# EAGLE schematic MotherForSmoothie_preliminary (EAGLE 6.6.0)
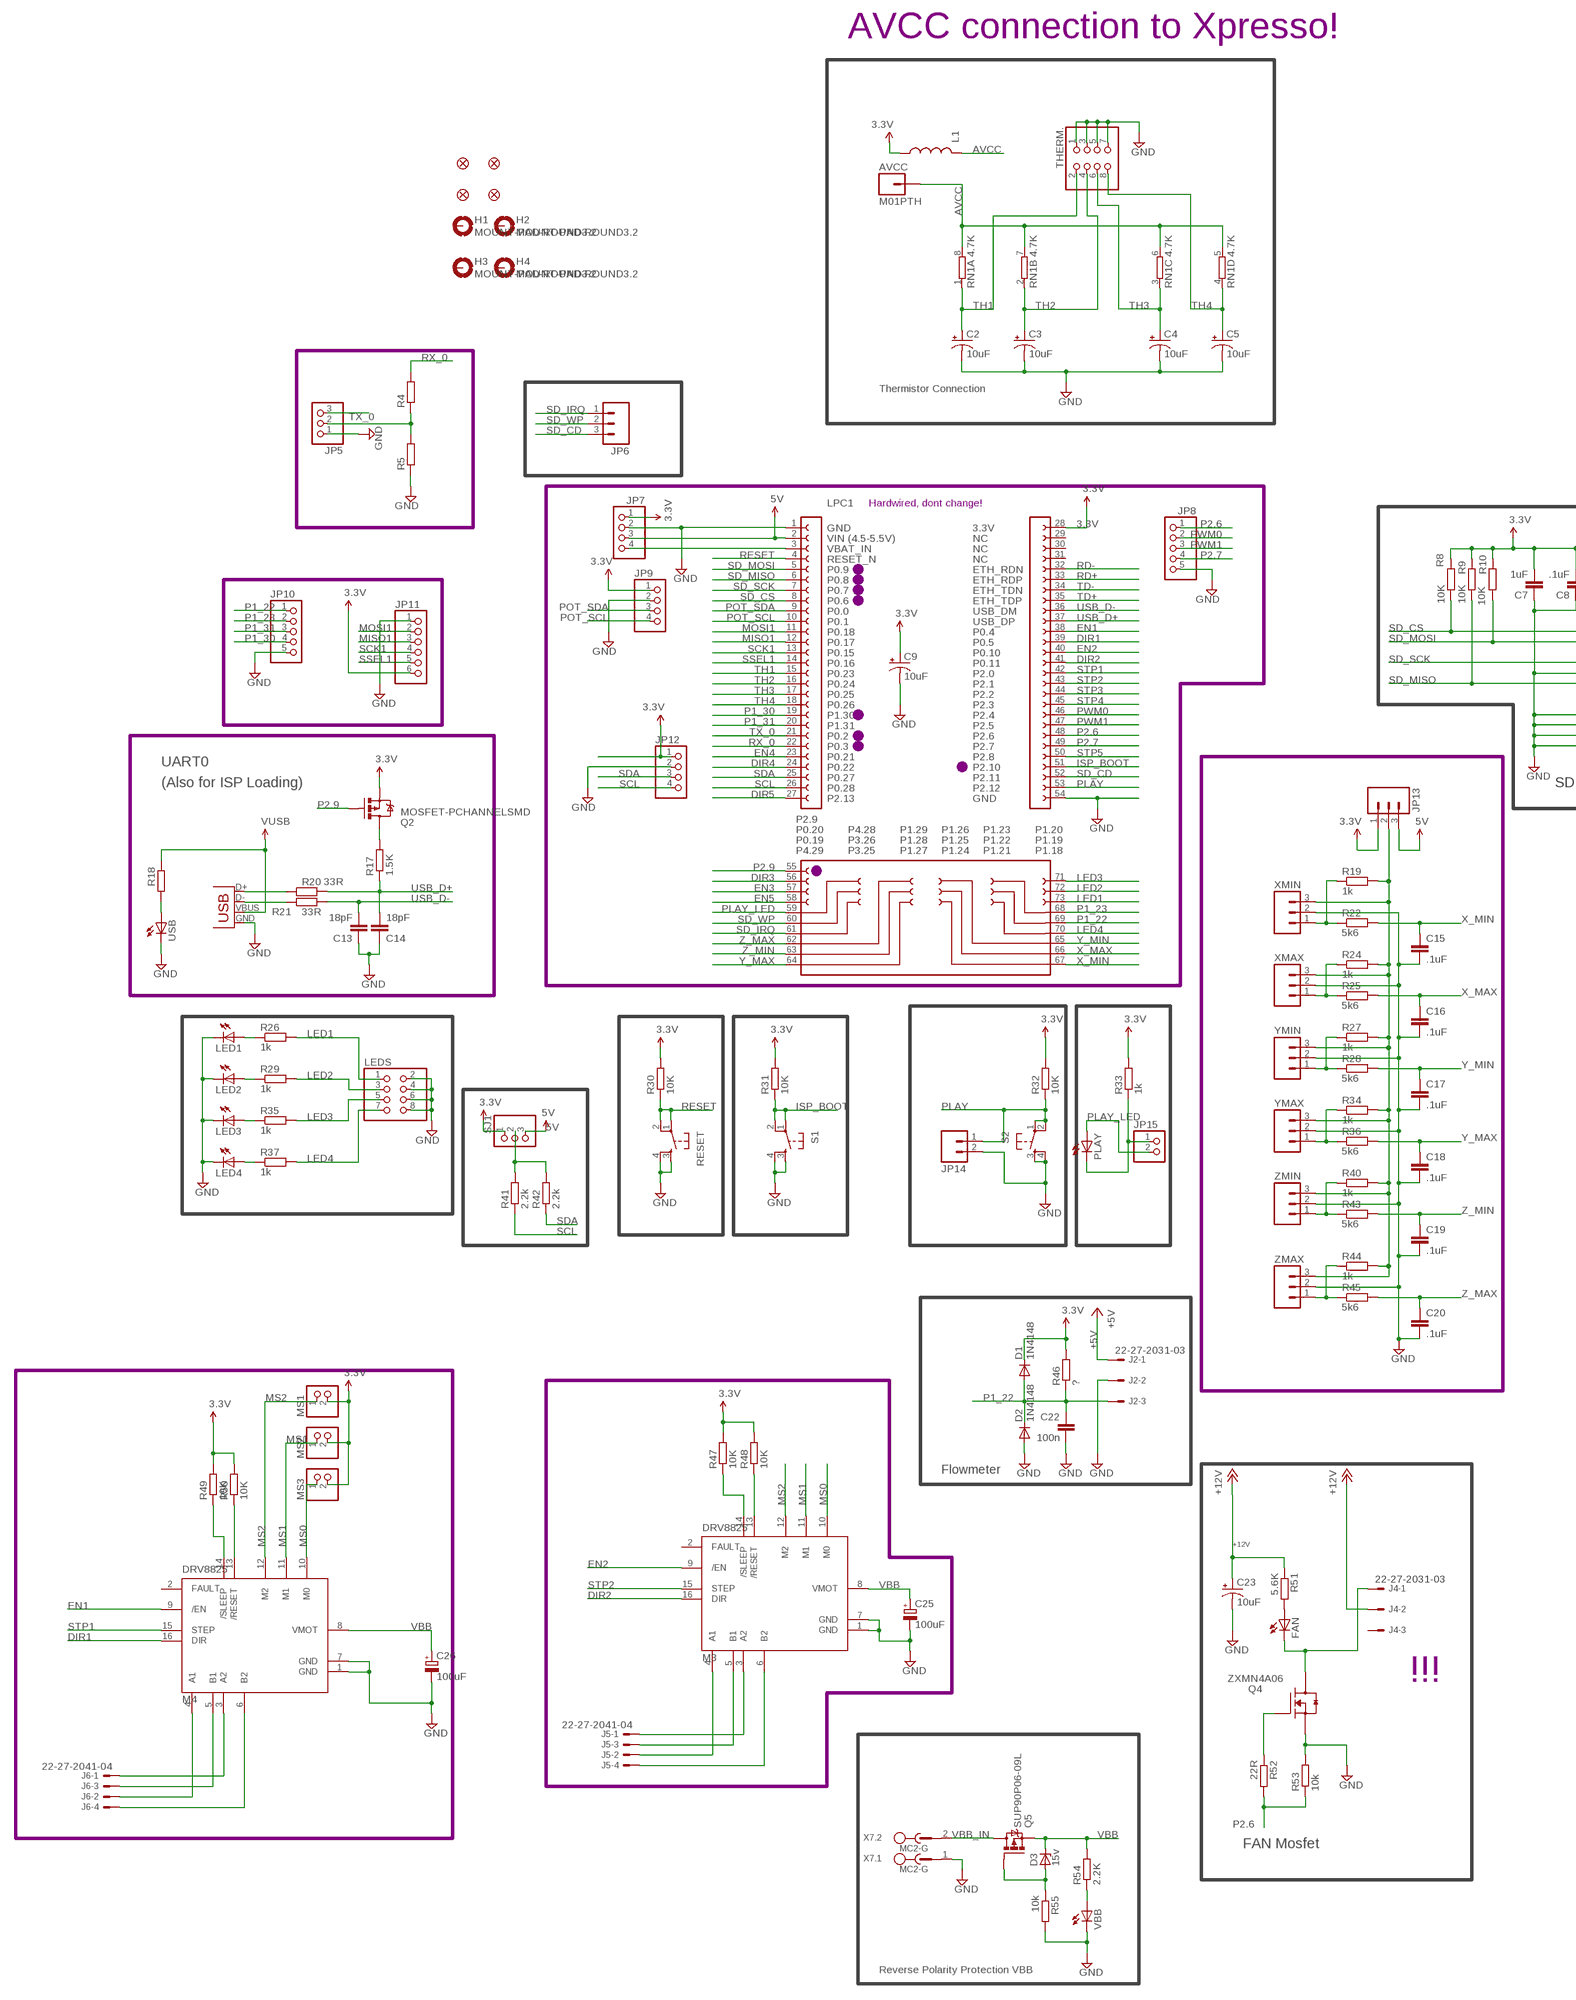
[diagram p0: schematic, sheet 1, part 1 of 2]
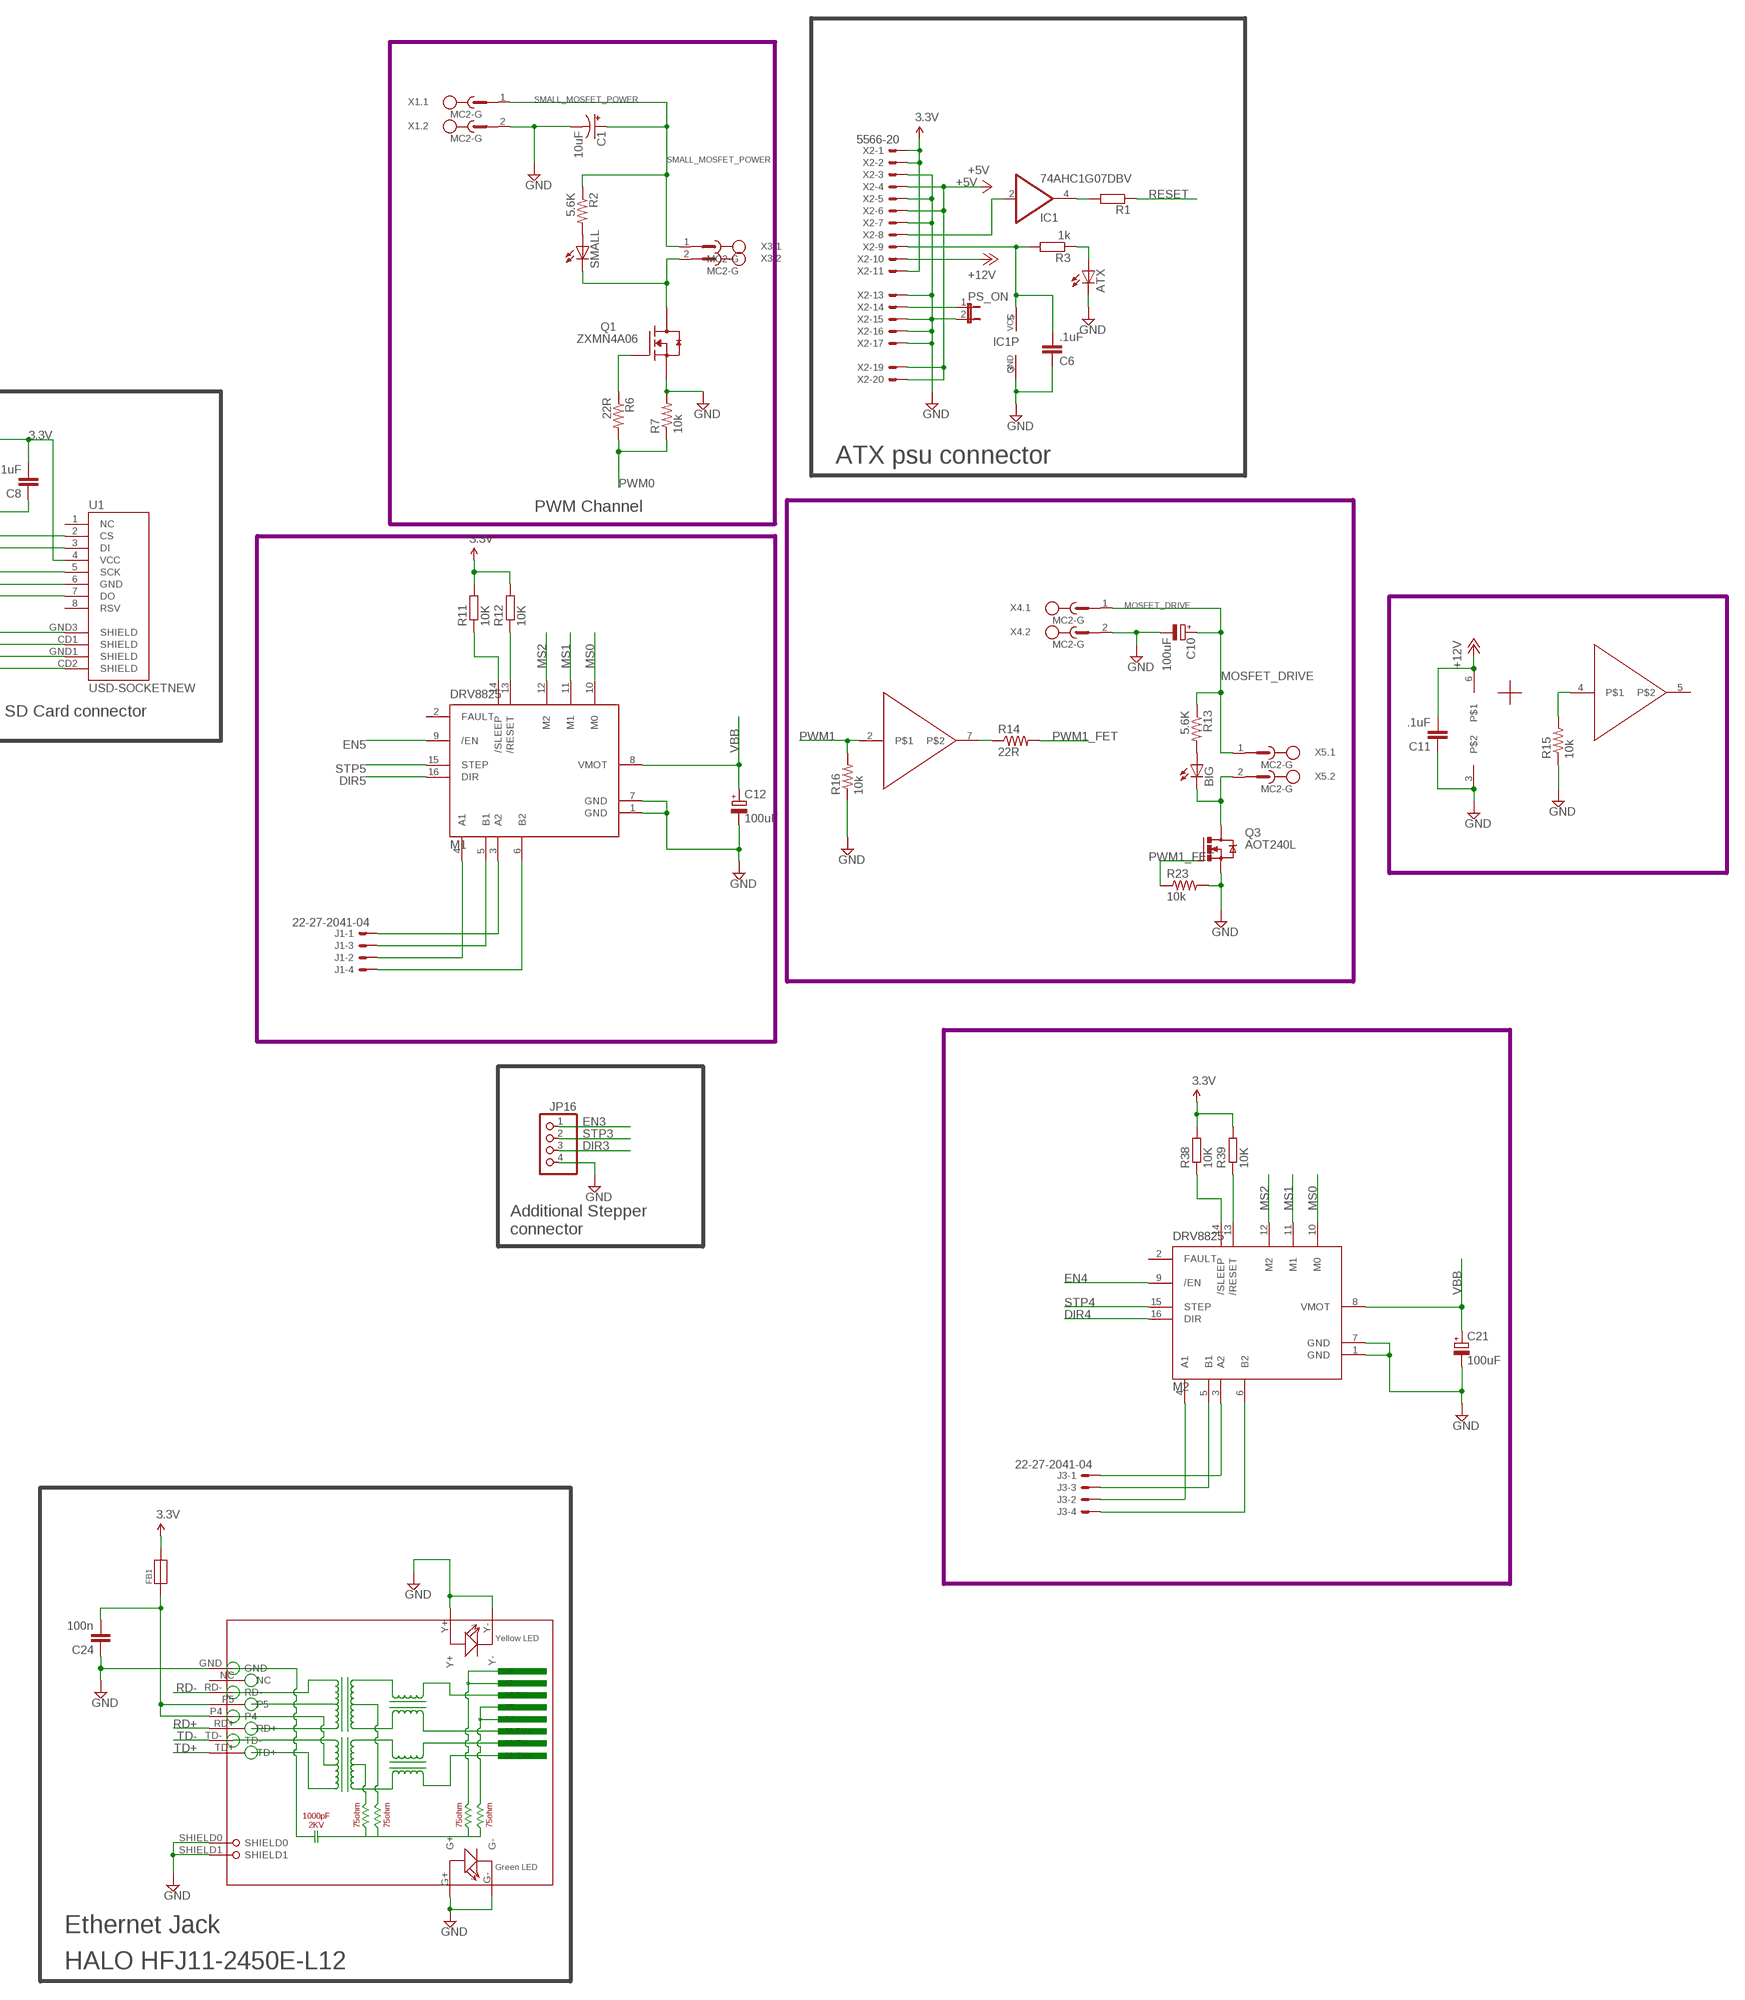
[diagram p1: schematic, sheet 1, part 2 of 2]

## Parts
ATX  LEDCHIPLED_0805  [CHIPLED_0805]
AVCC  M01PTH  [1X01]
BIG  LEDCHIP-LED0805  [CHIP-LED0805]
C1  10uF  CAP_POL1206  [EIA3216]
C2  10uF  CAP_POL1206  [EIA3216]
C3  10uF  CAP_POL1206  [EIA3216]
C4  10uF  CAP_POL1206  [EIA3216]
C5  10uF  CAP_POL1206  [EIA3216]
C6  .1uF  C-EUC0603  [C0603]
C7  1uF  C-EUC0603  [C0603]
C8  .1uF  C-EUC0603  [C0603]
C9  10uF  CAP_POL1206  [EIA3216]
C10  100uF  CPOL-EUE5-8.5  [E5-8,5]
C11  .1uF  C-EUC0603  [C0603]
C12  100uF  CPOL-EUE5-8.5  [E5-8,5]
C13  18pF  C-EUC0603  [C0603]
C14  18pF  C-EUC0603  [C0603]
C15  .1uF  C-EUC0603  [C0603]
C16  .1uF  C-EUC0603  [C0603]
C17  .1uF  C-EUC0603  [C0603]
C18  .1uF  C-EUC0603  [C0603]
C19  .1uF  C-EUC0603  [C0603]
C20  .1uF  C-EUC0603  [C0603]
C21  100uF  CPOL-EUE5-8.5  [E5-8,5]
C22  100n  C-EUC0603  [C0603]
C23  10uF  CAP_POL1206  [EIA3216]
C24  100n  C-EUC0603  [C0603]
C25  100uF  CPOL-EUE5-8.5  [E5-8,5]
C26  100uF  CPOL-EUE5-8.5  [E5-8,5]
D1  1N4148  DIODE-MINIMELF  [MINIMELF]
D2  1N4148  DIODE-MINIMELF  [MINIMELF]
D3  15v  ZENER-DIODESMB  [SMB]
FAN  LEDCHIPLED_0805  [CHIPLED_0805]
FB1  FERRITE  [0603]
H1  MOUNT-PAD-ROUND3.2  [3,2-PAD]
H2  MOUNT-PAD-ROUND3.2  [3,2-PAD]
H3  MOUNT-PAD-ROUND3.2  [3,2-PAD]
H4  MOUNT-PAD-ROUND3.2  [3,2-PAD]
IC1  74AHC1G07DBV  [SOT23-5]
IC2  TC4427  [SOIC8]
J1  22-27-2041-04  [6410-04]
J2  22-27-2031-03  [6410-03]
J3  22-27-2041-04  [6410-04]
J4  22-27-2031-03  [6410-03]
J5  22-27-2041-04  [6410-04]
J6  22-27-2041-04  [6410-04]
JP1  FIDUCIAL1X2  [FIDUCIAL-1X2]
JP2  FIDUCIAL1X2  [FIDUCIAL-1X2]
JP3  FIDUCIAL1X2  [FIDUCIAL-1X2]
JP4  FIDUCIAL1X2  [FIDUCIAL-1X2]
JP5  PINHD-1X3_2.54-SMD  [1X03SMD]
JP6  M031X03_NO_SILK  [1X03_NO_SILK]
JP7  PINHD-1X4_2.54-SMD  [1X04SMD]
JP8  PINHD-1X5_2.54-SMD  [1X05SMD]
JP9  PINHD-1X4_2.54-SMD  [1X04SMD]
JP10  PINHD-1X5_2.54-SMD  [1X05SMD]
JP11  PINHD-1X6_2.54-SMD  [1X06SMD]
JP12  PINHD-1X4_2.54-SMD  [1X04SMD]
JP13  M031X03_NO_SILK  [1X03_NO_SILK]
JP14  M02PTH  [1X02]
JP15  PINHD-1X2_2.54-SMD  [1X02SMD]
JP16  PINHD-1X4_2.54-SMD  [1X04SMD]
L1  INDUCTOR0603  [0603]
LED1  LEDCHIP-LED0805  [CHIP-LED0805]
LED2  LEDCHIP-LED0805  [CHIP-LED0805]
LED3  LEDCHIP-LED0805  [CHIP-LED0805]
LED4  LEDCHIP-LED0805  [CHIP-LED0805]
LEDS  PINHD-2X4_2.54-SMD  [2X04SMD]
LPC1  LPCXPRESSO_LPC1769SMD_PART  [LPCXPRESSO_LPC1769_SMD]
M1  DRV8825  [DRV8825]
M2  DRV8825  [DRV8825]
M3  DRV8825  [DRV8825]
M4  DRV8825  [DRV8825]
MS1  PINHD-1X2_2.54-SMD  [1X02SMD]
MS2  PINHD-1X2_2.54-SMD  [1X02SMD]
MS3  PINHD-1X2_2.54-SMD  [1X02SMD]
PLAY  LEDCHIPLED_0805  [CHIPLED_0805]
PS_ON  JP1E  [JP1]
Q1  ZXMN4A06  MOSFET-NCH_SOT-223  [SOT230P700X160-4N]
Q2  MOSFET-PCHANNELSMD  [SOT23-3]
Q3  AOT240L  IRF540  [TO220BV]
Q4  ZXMN4A06  MOSFET-NCH_SOT-223  [SOT230P700X160-4N]
Q5  SUP90P06-09L  IRF9530  [TO220BV]
R1  R-EU_R0603  [R0603]
R2  5.6K  R-US_R0603  [R0603]
R3  1k  R-EU_R0603  [R0603]
R4  R-EU_R0603  [R0603]
R5  R-EU_R0603  [R0603]
R6  22R  R-US_R0603  [R0603]
R7  10k  R-US_R0603  [R0603]
R8  10K  R-EU_R0603  [R0603]
R9  10K  R-EU_R0603  [R0603]
R10  10K  R-EU_R0603  [R0603]
R11  10K  R-EU_R0603  [R0603]
R12  10K  R-EU_R0603  [R0603]
R13  5.6K  R-US_R0603  [R0603]
R14  22R  R-US_R0603  [R0603]
R15  10k  R-US_R0603  [R0603]
R16  10k  R-US_R0603  [R0603]
R17  1.5K  R-EU_R0603  [R0603]
R18  R-EU_R0603  [R0603]
R19  1k  R-EU_R0603  [R0603]
R20  33R  R-EU_R0603  [R0603]
R21  33R  R-EU_R0603  [R0603]
R22  5k6  R-EU_R0603  [R0603]
R23  10k  R-US_R0603  [R0603]
R24  1k  R-EU_R0603  [R0603]
R25  5k6  R-EU_R0603  [R0603]
R26  1k  R-EU_R0603  [R0603]
R27  1k  R-EU_R0603  [R0603]
R28  5k6  R-EU_R0603  [R0603]
R29  1k  R-EU_R0603  [R0603]
R30  10K  R-EU_R0603  [R0603]
R31  10K  R-EU_R0603  [R0603]
R32  10K  R-EU_R0603  [R0603]
R33  1k  R-EU_R0603  [R0603]
R34  1k  R-EU_R0603  [R0603]
R35  1k  R-EU_R0603  [R0603]
R36  5k6  R-EU_R0603  [R0603]
R37  1k  R-EU_R0603  [R0603]
R38  10K  R-EU_R0603  [R0603]
R39  10K  R-EU_R0603  [R0603]
R40  1k  R-EU_R0603  [R0603]
R41  2.2k  R-EU_R0603  [R0603]
R42  2.2k  R-EU_R0603  [R0603]
R43  5k6  R-EU_R0603  [R0603]
R44  1k  R-EU_R0603  [R0603]
R45  5k6  R-EU_R0603  [R0603]
R46  ?  R-EU_R0603  [R0603]
R47  10K  R-EU_R0603  [R0603]
R48  10K  R-EU_R0603  [R0603]
R49  10K  R-EU_R0603  [R0603]
R50  10K  R-EU_R0603  [R0603]
R51  5.6K  R-EU_R0603  [R0603]
R52  22R  R-EU_R0603  [R0603]
R53  10k  R-EU_R0603  [R0603]
R54  2.2K  R-EU_R0603  [R0603]
R55  10k  R-EU_R0603  [R0603]
RESET  TAC_SWITCHSMD  [TACTILE_SWITCH_SMD]
RJ1  HR911105A  [HR911105A]
RN1  4.7K  4R-N0603-ARV  [0603-ARV]
S1  TAC_SWITCHSMD  [TACTILE_SWITCH_SMD]
S2  TAC_SWITCHSMD  [TACTILE_SWITCH_SMD]
SJ1  PINHD-1X3_2.54-SMD  [1X03SMD]
SMALL  LEDCHIP-LED0805  [CHIP-LED0805]
THERM.  PINHD-2X4MICROMATCH-SMD  [SMDTOP8]
U1  USD-SOCKETNEW  [MICRO-SD-SOCKET-PP]
USB  LEDCHIPLED_0805  [CHIPLED_0805]
VBB  LEDCHIPLED_0805  [CHIPLED_0805]
X1  MC2-G  [MC2-G]
X2  5566-20  [5566-20]
X3  MC2-G  [MC2-G]
X4  MC2-G  [MC2-G]
X5  MC2-G  [MC2-G]
X6  USB-MICROB  [USB-MICROB]
X7  MC2-G  [MC2-G]
XMAX  M031X03_NO_SILK  [1X03_NO_SILK]
XMIN  M031X03_NO_SILK  [1X03_NO_SILK]
YMAX  M031X03_NO_SILK  [1X03_NO_SILK]
YMIN  M031X03_NO_SILK  [1X03_NO_SILK]
ZMAX  M031X03_NO_SILK  [1X03_NO_SILK]
ZMIN  M031X03_NO_SILK  [1X03_NO_SILK]

## Nets
3.3V: C7.2 C8.2 C9.A(+) D1.C FB1.2 JP7.1 JP9.1 JP11.6 JP12.1 JP13.1 L1.2 LPC1.28 MS1.2 MS2.2 MS3.2 Q2.2(S) R8.2 R9.2 R10.2 R11.2 R12.2 R30.2 R31.2 R32.2 R33.2 R38.2 R39.2 R46.2 R47.2 R48.2 R49.2 R50.2 SJ1.1 U1.4(VCC) X2.1 X2.2 X2.11
5V: JP7.3 JP13.3 LPC1.2 SJ1.3
+5V: J2.1 X2.4 X2.6 X2.19 X2.20
+12V: C11.2 C23.A(+) IC2.6 J4.2 R51.1 X2.10
AVCC: AVCC.1 L1.1 RN1.5 RN1.6 RN1.7 RN1.8
DIR1: LPC1.39 M4.16(DIR)
DIR2: LPC1.41 M3.16(DIR)
DIR3: JP16.3 LPC1.56
DIR4: LPC1.24 M2.16(DIR)
DIR5: LPC1.27 M1.16(DIR)
EN1: LPC1.38 M4.9(/EN)
EN2: LPC1.40 M3.9(/EN)
EN3: JP16.1 LPC1.57
EN4: LPC1.23 M2.9(/EN)
EN5: LPC1.58 M1.9(/EN)
GND: ATX.C C1.C(-) C2.C(-) C3.C(-) C4.C(-) C5.C(-) C6.1 C7.1 C8.1 C9.C(-) C10.- C11.1 C12.- C13.1 C14.1 C15.2 C16.2 C17.2 C18.2 C19.2 C20.2 C21.- C22.2 C23.C(-) C24.1 C25.- C26.- D2.A IC1.3(GND) IC2.3 J2.2 JP5.1 JP7.2 JP8.5 JP9.2 JP10.5 JP11.1 JP12.2 JP14.2 JP16.4 LED1.C LED2.C LED3.C LED4.C LEDS.2 LEDS.4 LEDS.6 LEDS.8 LPC1.1 LPC1.54 M1.1(GND) M1.7(GND) M2.1(GND) M2.7(GND) M3.1(GND) M3.7(GND) M4.1(GND) M4.7(GND) PS_ON.2 Q1.3(S) Q3.S Q4.3(S) R5.1 R7.2 R15.1 R16.1 R23.2 R53.2 R55.2 RESET.3 RESET.4 RJ1.G+ RJ1.G- RJ1.GND RJ1.SHIELD0 RJ1.SHIELD1 RJ1.Y+ RJ1.Y- S1.3 S1.4 S2.3 S2.4 THERM..1 THERM..3 THERM..5 THERM..7 U1.6(GND) U1.CD1(SHIELD) U1.CD2(SHIELD) U1.GND1(SHIELD) U1.GND3(SHIELD) USB.C VBB.C X1.2 X2.3 X2.5 X2.7 X2.13 X2.15 X2.16 X2.17 X4.2 X6.GND X7.1 XMAX.2 XMIN.2 YMAX.2 YMIN.2 ZMAX.2 ZMIN.2
ISP_BOOT: LPC1.51 R31.1 S1.1 S1.2
LED1: LEDS.1 LPC1.73 R26.2
LED2: LEDS.3 LPC1.72 R29.2
LED3: LEDS.5 LPC1.71 R35.2
LED4: LEDS.7 LPC1.70 R37.2
MISO1: JP11.3 LPC1.12
MOSFET_DRIVE: C10.+ R13.1 X4.1 X5.1
MOSI1: JP11.2 LPC1.11
MS0: M1.10(M0) M2.10(M0) M3.10(M0) M4.10(M0) MS3.1
MS1: M1.11(M1) M2.11(M1) M3.11(M1) M4.11(M1) MS2.1
MS2: M1.12(M2) M2.12(M2) M3.12(M2) M4.12(M2) MS1.1
N$1: R20.1 X6.D+
N$2: R21.1 X6.D-
N$3 [StepCur]: J6.3 M4.5(B1)
N$4 [StepCur]: J6.4 M4.6(B2)
N$5: LED4.A R37.1
N$6: LED3.A R35.1
N$7: LED2.A R29.1
N$8 [StepCur]: J6.2 M4.4(A1)
N$9 [StepCur]: J6.1 M4.3(A2)
N$10: LED1.A R26.1
N$11 [StepCur]: J3.3 M2.5(B1)
N$12: Q2.3(D) R17.2
N$13 [StepCur]: J3.4 M2.6(B2)
N$14: JP13.2 R19.2 R24.2 R27.2 R34.2 R40.2 R44.2 XMAX.3 XMIN.3 YMAX.3 YMIN.3 ZMAX.3 ZMIN.3
N$15: R40.1 R43.1 ZMIN.1
N$16: R19.1 R22.1 XMIN.1
N$17: M4.14(/SLEEP) R49.1
N$18: R24.1 R25.1 XMAX.1
N$19: R27.1 R28.1 YMIN.1
N$20: R34.1 R36.1 YMAX.1
N$21 [StepCur]: J3.2 M2.4(A1)
N$22 [StepCur]: J5.3 M3.5(B1)
N$23: JP7.4 LPC1.3
N$24: R44.1 R45.1 ZMAX.1
N$25 [StepCur]: J5.4 M3.6(B2)
N$26 [StepCur]: J5.2 M3.4(A1)
N$27: R41.2 R42.2 SJ1.2
N$28 [StepCur]: J5.1 M3.3(A2)
N$30: M3.14(/SLEEP) R47.1
N$31 [StepCur]: J3.1 M2.3(A2)
N$32: M2.14(/SLEEP) R38.1
N$33: M2.13(/RESET) R39.1
N$34: C6.2 IC1.5(VCC) R3.2 X2.9
N$35: IC1.2(I) X2.8
N$36: ATX.A R3.1
N$37: PS_ON.1 X2.14
N$38: JP5.2 R4.1 R5.2
N$39: IC1.4(O) R1.2
N$40: IC2.7 R14.1
N$41: R18.1 USB.A
N$67: M4.13(/RESET) R50.1
N$68: M3.13(/RESET) R48.1
N$74: Q1.1(G) R6.1
N$81: R2.2 SMALL.A
N$88: Q1.4(D) SMALL.C X3.2
N$92: BIG.C Q3.D X5.2
N$96: FAN.C J4.1 Q4.4(D)
N$105: BIG.A R13.2
N$107: Q4.1(G) R52.1
N$126: R54.1 VBB.A
N$128: FAN.A R51.2
N$135: D3.A Q5.G R55.1
N$140: C24.2 FB1.1 RJ1.P4 RJ1.P5
N$146 [StepCur]: J1.3 M1.5(B1)
N$147 [StepCur]: J1.4 M1.6(B2)
N$148 [StepCur]: J1.2 M1.4(A1)
N$149 [StepCur]: J1.1 M1.3(A2)
N$152: M1.14(/SLEEP) R11.1
N$153: M1.13(/RESET) R12.1
N$234234: JP15.1 PLAY.C R33.1
P1_22: C22.1 D1.A D2.C J2.3 JP10.1 LPC1.69 R46.1
P1_23: JP10.2 LPC1.68
P1_30: JP10.4 LPC1.19
P1_31: JP10.3 LPC1.20
P2.6: JP8.1 LPC1.48 R52.2 R53.1
P2.7: JP8.4 LPC1.49
P2.9: LPC1.55 Q2.1(G)
PLAY: JP14.1 LPC1.53 R32.1 S2.1 S2.2
PLAY_LED: JP15.2 LPC1.59 PLAY.A
POT_SCL: JP9.4 LPC1.10
POT_SDA: JP9.3 LPC1.9
PWM0: JP8.2 LPC1.46 R6.2 R7.1
PWM1: IC2.2 JP8.3 LPC1.47 R16.2
PWM1_FET: Q3.G R14.2 R23.1
RD+: LPC1.33 RJ1.RD+
RD-: LPC1.32 RJ1.RD-
RESET: LPC1.4 R1.1 R30.1 RESET.1 RESET.2
RX_0: LPC1.22 R4.2
SCK1: JP11.4 LPC1.13
SCL: JP12.4 LPC1.26 R41.1
SD_CD: JP6.3 LPC1.52
SD_CS: LPC1.8 R8.1 U1.2(CS)
SD_IRQ: JP6.1 LPC1.61
SD_MISO: LPC1.6 R9.1 U1.7(DO)
SD_MOSI: LPC1.5 R10.1 U1.3(DI)
SD_SCK: LPC1.7 U1.5(SCK)
SD_WP: JP6.2 LPC1.60
SDA: JP12.3 LPC1.25 R42.1
SMALL_MOSFET_POWER: C1.A(+) R2.1 X1.1 X3.1
SSDFGSDFG: IC2.4 R15.2
SSEL1: JP11.5 LPC1.14
STP1: LPC1.42 M4.15(STEP)
STP2: LPC1.43 M3.15(STEP)
STP3: JP16.2 LPC1.44
STP4: LPC1.45 M2.15(STEP)
STP5: LPC1.50 M1.15(STEP)
TD+: LPC1.35 RJ1.TD+
TD-: LPC1.34 RJ1.TD-
TH1: C2.A(+) LPC1.15 RN1.1 THERM..2
TH2: C3.A(+) LPC1.16 RN1.2 THERM..4
TH3: C4.A(+) LPC1.17 RN1.3 THERM..6
TH4: C5.A(+) LPC1.18 RN1.4 THERM..8
TX_0: JP5.3 LPC1.21
USB_D+: C14.2 LPC1.37 R17.1 R20.2
USB_D-: C13.2 LPC1.36 R21.2
VBB: C12.+ C21.+ C25.+ C26.+ D3.C M1.8(VMOT) M2.8(VMOT) M3.8(VMOT) M4.8(VMOT) Q5.S R54.2
VBB_IN: Q5.D X7.2
VUSB: R18.2 X6.VBUS
X_MAX: C16.1 LPC1.66 R25.2
X_MIN: C15.1 LPC1.67 R22.2
Y_MAX: C18.1 LPC1.64 R36.2
Y_MIN: C17.1 LPC1.65 R28.2
Z_MAX: C20.1 LPC1.62 R45.2
Z_MIN: C19.1 LPC1.63 R43.2
Unconnected: H1.B3,2(MOUNT) H2.B3,2(MOUNT) H3.B3,2(MOUNT) H4.B3,2(MOUNT) IC2.5 J4.3 LPC1.29 LPC1.30 LPC1.31 M1.2(FAULT) M2.2(FAULT) M3.2(FAULT) M4.2(FAULT) RJ1.NC U1.1(NC) U1.8(RSV) X2.12 X2.18

## Notes on the sheet
- AVCC connection to Xpresso!
- Thermistor Connection
- Hardwired, dont change!
- ATX psu connector
- PWM Channel
- UART0
- (Also for ISP Loading) | SD Card connector
- Additional Stepper
  connector
- Flowmeter
- !!!
- Ethernet Jack
- FAN Mosfet
- HALO HFJ11-2450E-L12
- Reverse Polarity Protection VBB

## Library data of the parts
ATX BIG FAN LED1-LED4 PLAY SMALL USB VBB = led:LED: LED OSRAM: - CHIPLED LG R971, LG N971, LY N971, LG Q971, LY Q971, LO R971, LY R971 LH N974, LH R974 LS Q976, LO Q976, LY Q976 LO Q996 - Hyper CHIPLED LW Q18S LB Q993, LB Q99A, LB R99A - SideLED LS A670, LO A670, LY A670, LG A670, LP A670 LB A673, LV A673, LT A673, LW A673 LH A674 LY A675 LS A676, LA A676, LO A676, LY A676, LW A676 LS A679, LY A679, LG A679 - Hyper Micro SIDELED® LS Y876, LA Y876, LO Y876, LY Y876 LT Y87S - SmartLED LW L88C, LW L88S LB L89C, LB L89S, LG L890 LS L89K, LO L89K, LY L89K LS L896, LA L896, LO L896, LY L896 - TOPLED LS T670, LO T670, LY T670, LG T670, LP T670 LSG T670, LSP T670, LSY T670, LOP T670, LYG T670 LG T671, LOG T671, LSG T671 LB T673, LV T673, LT T673, LW T673 LH T674 LS T676, LA T676, LO T676, LY T676, LB T676, LH T676, LSB T676, LW T676 LB T67C, LV T67C, LT T67C, LS T67K, LO T67K, LY T67K, LW E67C LS E67B, LA E67B, LO E67B, LY E67B, LB E67C, LV E67C, LT E67C LW T67C LS T679, LY T679, LG T679 LS T770, LO T770, LY T770, LG T770, LP T770 LB T773, LV T773, LT T773, LW T773 LH T774 LS E675, LA E675, LY E675, LS T675 LS T776, LA T776, LO T776, LY T776, LB T776 LHGB T686 LT T68C, LB T68C - Hyper Mini TOPLED® LB M676 - Mini TOPLED Santana® LG M470 LS M47K, LO M47K, LY M47K Source: http://www.osram.convergy.de LUXEON: - LUMILED® LXK2-PW12-R00, LXK2-PW12-S00, LXK2-PW14-U00, LXK2-PW14-V00 LXK2-PM12-R00, LXK2-PM12-S00, LXK2-PM14-U00 LXK2-PE12-Q00, LXK2-PE12-R00, LXK2-PE12-S00, LXK2-PE14-T00, LXK2-PE14-U00 LXK2-PB12-K00, LXK2-PB12-L00, LXK2-PB12-M00, LXK2-PB14-N00, LXK2-PB14-P00, LXK2-PB14-Q00 LXK2-PR12-L00, LXK2-PR12-M00, LXK2-PR14-Q00, LXK2-PR14-R00 LXK2-PD12-Q00, LXK2-PD12-R00, LXK2-PD12-S00 LXK2-PH12-R00, LXK2-PH12-S00 LXK2-PL12-P00, LXK2-PL12-Q00, LXK2-PL12-R00 Source: www.luxeon.com KINGBRIGHT: KA-3528ASYC Source: www.kingbright.com
AVCC = SparkFun:M01: Header 1 Standard 1-pin 0.1" header. Use with straight break away headers (SKU : PRT-00116), right angle break away headers (PRT-00553), swiss pins (PRT-00743), machine pins (PRT-00117), and female headers (PRT-00115).
C1-C5 C9 C23 = SparkFun:CAP_POL: Capacitor Polarized These are standard SMD and PTH capacitors. Normally 10uF, 47uF, and 100uF in electrolytic and tantalum varieties. Always verify the external diameter of the through hole cap, it varies with capacity, voltage, and manufacturer. The EIA devices should be standard.
C6-C8 C11 C13-C20 C22 C24 = rcl:C-EU: CAPACITOR, European symbol
C10 C12 C21 C25 C26 = rcl:CPOL-EU: POLARIZED CAPACITOR, European symbol
D1 D2 = diode:DIODE-: DIODE
D3 = diode:ZENER-DIODE: Z-Diode
FB1 = microbuilder:FERRITE: Ferrite Bead 0603 MMZ1608B121C - 120 Ohm, 600mA Ferrite Chip - Digikey: 445-2164-1-ND BK1608HW121-T - 120 Ohm, 600mA Ferrite Chip - Digikey: 587-1876-2-ND
H1-H4 = holes:MOUNT-PAD-ROUND: MOUNTING PAD, round
IC1 = 74xx-little-de:74*1G07: Single Buffer/Driver With Open-Drain Output
IC2 = custom_esorensen:TC4427
J1 J3 J5 J6 = con-molex:22-?-04: CONNECTOR wire to board 2.54 mm (.1 inch) pitch header
J2 J4 = con-molex:22-?-03: CONNECTOR wire to board 2.54 mm (.1 inch) pitch header
JP1-JP4 = SparkFun:FIDUCIAL: Fiducial Alignment Points Various fiducial points for machine vision alignment.
JP5 SJ1 = pinhead (3):PINHD-1X3: PIN HEADER
JP6 JP13 XMAX XMIN YMAX YMIN ZMAX ZMIN = SparkFun:M03: Header 3 Standard 3-pin 0.1" header. Use with straight break away headers (SKU : PRT-00116), right angle break away headers (PRT-00553), swiss pins (PRT-00743), machine pins (PRT-00117), and female headers (PRT-00115). Molex polarized connector foot print use with SKU : PRT-08232 with associated crimp pins and housings.
JP7 JP9 JP12 JP16 = pinhead (3):PINHD-1X4: PIN HEADER
JP8 JP10 = pinhead (3):PINHD-1X5: PIN HEADER
JP11 = pinhead (3):PINHD-1X6: PIN HEADER
JP14 = SparkFun:M02: Header 2 Standard 2-pin 0.1" header. Use with straight break away headers (SKU : PRT-00116), right angle break away headers (PRT-00553), swiss pins (PRT-00743), machine pins (PRT-00117), and female headers (PRT-00115). Molex polarized connector foot print use with SKU : PRT-08233 with associated crimp pins and housings.
JP15 MS1-MS3 = pinhead (3):PINHD-1X2: PIN HEADER
L1 = SparkFun:INDUCTOR: Inductors Basic Inductor/Choke - 0603 and 1206. Footprints are not proven and vary greatly between part numbers.
LEDS THERM. = pinhead (3):PINHD-2X4: PIN HEADER
LPC1 = Selfextended_LPCXpresso_boards:LPCXPRESSO_LPC1769
M1-M4 = selfmade2:DRV8825
PS_ON = jumper:JP1E: JUMPER
Q1 Q4 = ipc-7351-transistor:MOSFET-NCH_
Q2 = SparkFun:MOSFET-PCHANNEL
Q3 = transistor-power:IRF540: HEXFET Power MOSFET
Q5 = transistor-power:IRF9530: P-CHANNEL HEXFET POWER-MOS-FET Source: http://www.irf.com/product-info/datasheets/data/irf9530.pdf
R1 R3-R5 R8-R12 R17-R22 R24-R55 = rcl:R-EU_: RESISTOR, European symbol
R2 R6 R7 R13-R16 R23 = resistor:R-US_: RESISTOR, American symbol
RESET S1 S2 = SparkFun:TAC_SWITCH: Momentary Switch Button commonly used for reset or general input. Spark Fun Electronics SKU : COM-00097
RJ1 = Itead_BP_110825.lbr:HR911105A: SOC006
RN1 = resistor-dil:4R-N: Array Chip Resistor Source: RS Component / Phycomp
U1 = SparkFun:USD-SOCKET: microSD Socket Push-push type uSD socket. Schematic element and footprint production proven. Spark Fun Electronics SKU : PRT-00127. tDoc lines correctly indicate media card edge positions when inserting (unlocked, locked, depressed).
X1 X3-X5 X7 = con-phoenix-381_l:MC2-G: Mini-Combicon 3.81mm horizontal 2-polig MC 1,5/2-G-3,81 Artikel-Nr. 1803277 mit Gegenstecker MC 1,5/2-ST-3,81 Artikel-Nr. 1803578
X2 = con-molex:5566-20: Mini FIT connector 20 pol ATX PC-Motherboard Power connector Source: http://www.molex.com
X6 = SparkFun:USB: USB Connectors USB-B-PTH is fully proven SKU : PRT-00139 USB-miniB is fully proven SKU : PRT-00587 USB-A-PCB is untested. USB-A-H is throughly reviewed, but untested. Spark Fun Electronics SKU : PRT-00437 USB-B-SMT is throughly reviewed, but untested. Needs silkscreen touching up. USB-A-S has not been used/tested USB-MB-H has not been used/tested

## Net classes
1 StepCur: width 1.2 mm, drill 0.6 mm
2 11A: width 3.5 mm, drill 2 mm